# Altium schematic sheet 06 AUDIO.SchDoc
size 513 x 386 mm
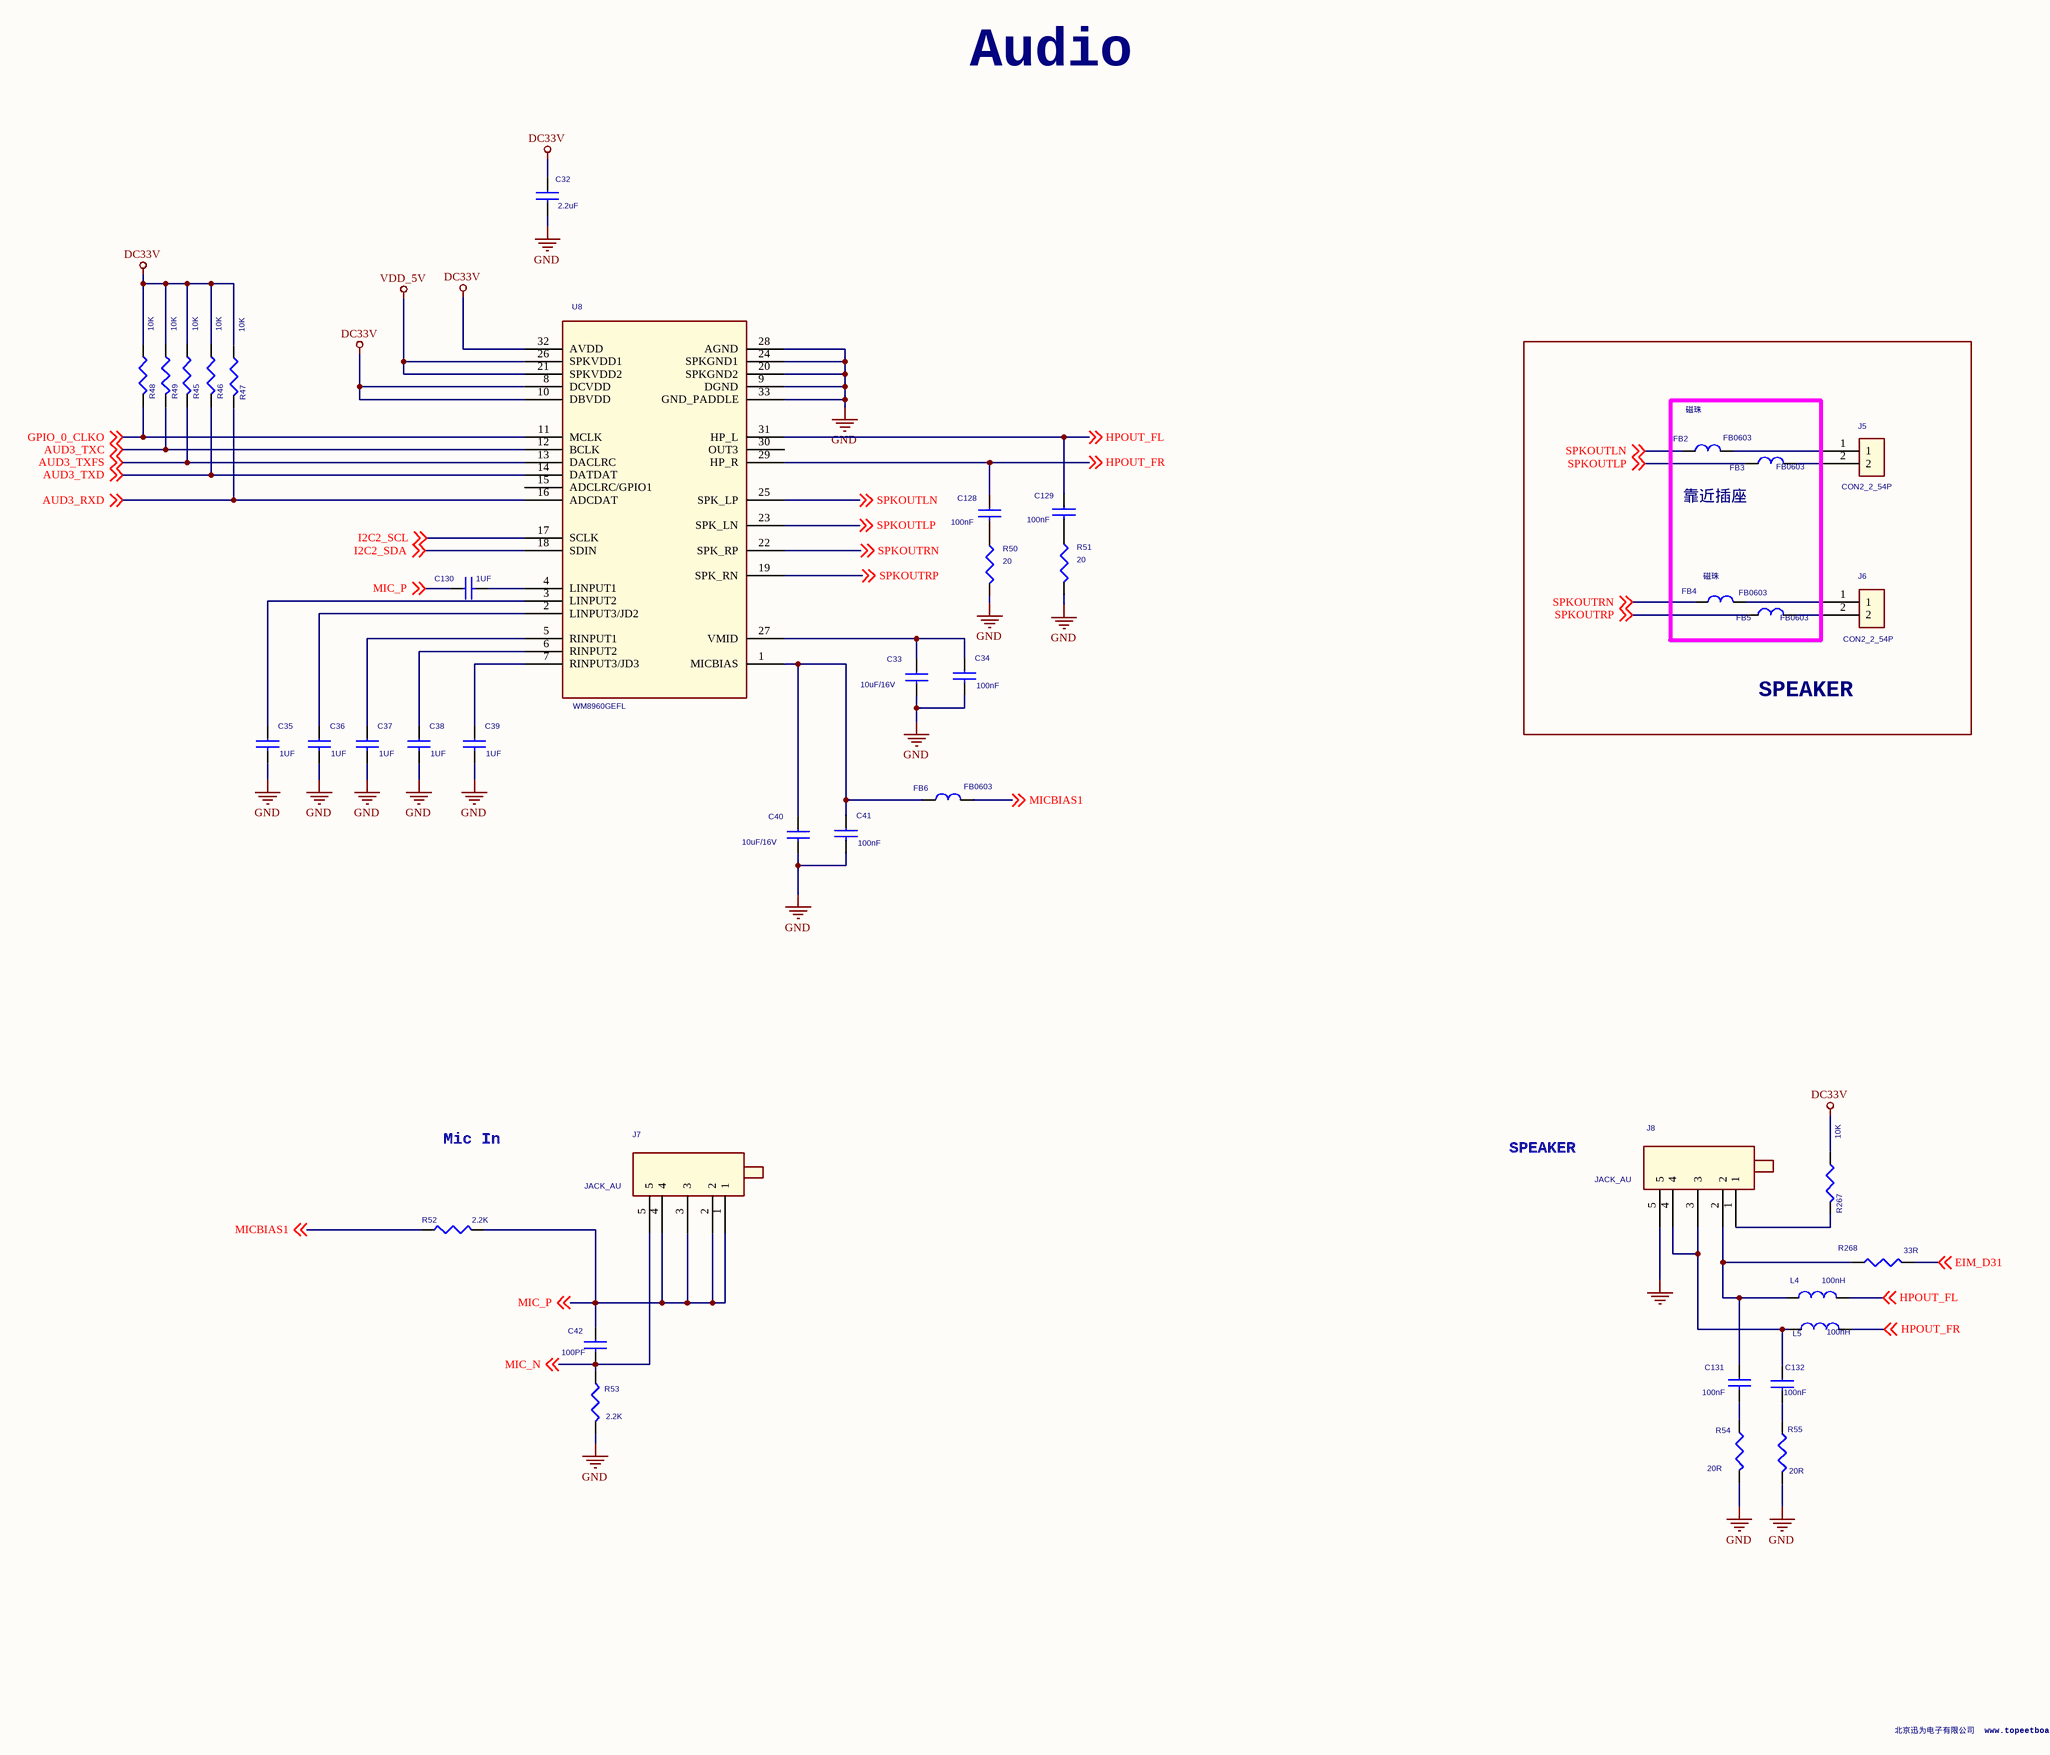
[diagram p0: 06 AUDIO.SchDoc]

## Parts
C32  2.2uF  [C0603]
C33  10uF/16V  [C0603]
C34  100nF  [C0603]
C35  1UF  [C0603]
C36  1UF  [C0603]
C37  1UF  [C0603]
C38  1UF  [C0603]
C39  1UF  [C0603]
C40  10uF/16V  [C0603]
C41  100nF  [C0603]
C42  100PF  [C1608]
C128  100nF  [C1608]
C129  100nF  [C1608]
C130  1UF  [C1608]
C131  100nF  [C1608]
C132  100nF  [C1608]
FB2  FB0603  [1206-A]
FB3  FB0603  [1206-A]
FB4  FB0603  [1206-A]
FB5  FB0603  [1206-A]
FB6  FB0603  [1206-A]
J5  CON2_2_54P  [a4b-2pa-2_54dsa]
J6  CON2_2_54P  [a4b-2pa-2_54dsa]
J7  JACK_AU  [ear_jack]
J8  JACK_AU  [ear_jack]
L4  100nH  [LQH32C]
L5  100nH  [LQH32C]
R45  10K  [R0402]
R46  10K  [R0402]
R47  10K  [R0402]
R48  10K  [R0402]
R49  10K  [R0402]
R50  20  [R1005]
R51  20  [R1005]
R52  2.2K  [R1005]
R53  2.2K  [R1005]
R54  20R  [R1005]
R55  20R  [R1005]
R267  10K  [R0402]
R268  33R  [R1005]
U8  WM8960GEFL  [QFN32-050-5X5LH]

## Blocks framed on the sheet
SPEAKER: J5 J6
靠近插座: FB2-FB5

## Nets
DC33V: C32.1 R45.1 R46.1 R47.1 R48.1 R49.1 R267.1 U8.8(DCVDD) U8.10(DBVDD) U8.32(AVDD)
GND: C32.2 C33.2 C34.2 C35.2 C36.2 C37.2 C38.2 C39.2 C40.2 C41.2 J8.5 R50.2 R51.2 R53.2 R54.2 R55.2 U8.9(DGND) U8.20(SPKGND2) U8.24(SPKGND1) U8.28(AGND) U8.33(GND_PADDLE)
VDD_5V: U8.21(SPKVDD2) U8.26(SPKVDD1)
AUD3_RXD: R47.2 U8.16(ADCDAT) ; off-sheet AUD3_RXD
AUD3_TXC: R49.2 U8.12(BCLK) ; off-sheet AUD3_TXC
AUD3_TXD: R46.2 U8.14(DATDAT) ; off-sheet AUD3_TXD
AUD3_TXFS: R45.2 U8.13(DACLRC) ; off-sheet AUD3_TXFS
EIM_D31: R268.2 ; off-sheet EIM_D31
GPIO_0_CLKO: R48.2 U8.11(MCLK) ; off-sheet GPIO_0_CLKO
HPOUT_FL: C129.1 L4.2 U8.31(HP_L) ; off-sheet HPOUT_FL
HPOUT_FR: C128.1 L5.2 U8.29(HP_R) ; off-sheet HPOUT_FR
I2C2_SCL: U8.17(SCLK) ; off-sheet I2C2_SCL
I2C2_SDA: U8.18(SDIN) ; off-sheet I2C2_SDA
MIC_N: C42.2 J7.5 R53.1 ; off-sheet MIC_N
MIC_P: C42.1 C130.1 J7.1 J7.2 J7.3 J7.4 R52.2 ; off-sheet MIC_P
MICBIAS1: FB6.2 R52.1 ; off-sheet MICBIAS1
SPKOUTLN: FB2.1 U8.25(SPK_LP) ; off-sheet SPKOUTLN
SPKOUTLP: FB3.1 U8.23(SPK_LN) ; off-sheet SPKOUTLP
SPKOUTRN: FB4.1 U8.22(SPK_RP) ; off-sheet SPKOUTRN
SPKOUTRP: FB5.1 U8.19(SPK_RN) ; off-sheet SPKOUTRP
NetC33_1: C33.1 C34.1 U8.27(VMID)
NetC35_1: C35.1 U8.3(LINPUT2)
NetC36_1: C36.1 U8.2(LINPUT3/JD2)
NetC37_1: C37.1 U8.5(RINPUT1)
NetC38_1: C38.1 U8.6(RINPUT2)
NetC39_1: C39.1 U8.7(RINPUT3/JD3)
NetC40_1: C40.1 C41.1 FB6.1 U8.1(MICBIAS)
NetC128_2: C128.2 R50.1
NetC129_2: C129.2 R51.1
NetC130_2: C130.2 U8.4(LINPUT1)
NetC131_1: C131.1 J8.2 L4.1 R268.1
NetC131_2: C131.2 R54.1
NetC132_1: C132.1 J8.3 J8.4 L5.1
NetC132_2: C132.2 R55.1
NetFB2_2: FB2.2 J5.1
NetFB3_2: FB3.2 J5.2
NetFB4_2: FB4.2 J6.1
NetFB5_2: FB5.2 J6.2
NetJ8_1: J8.1 R267.2

Not connected (* = marked no-connect by the designer): U8 15(ADCLRC/GPIO1) 30(OUT3)

## Notes on the sheet
- Audio
- (near FB2) 磁珠
- (near FB4) 磁珠
- Mic In
- SPEAKER
- 北京迅为电子有限公司  www.topeetboard.com

## Library data of the parts
C32-C41 = C0603_0_Dup1
C42 = C1608
C128-C132 = C1608_Dup1
FB2-FB6 = FB1206_0
L4 L5 = LQH32C_0_Dup2
R45-R49 R267 = R
R50-R55 R268 = R1005_0_Dup1
U8 = WM8960GEFL_0